# EasyEDA schematic SCH_Naked_ATMega_2560_2021-08-20.json
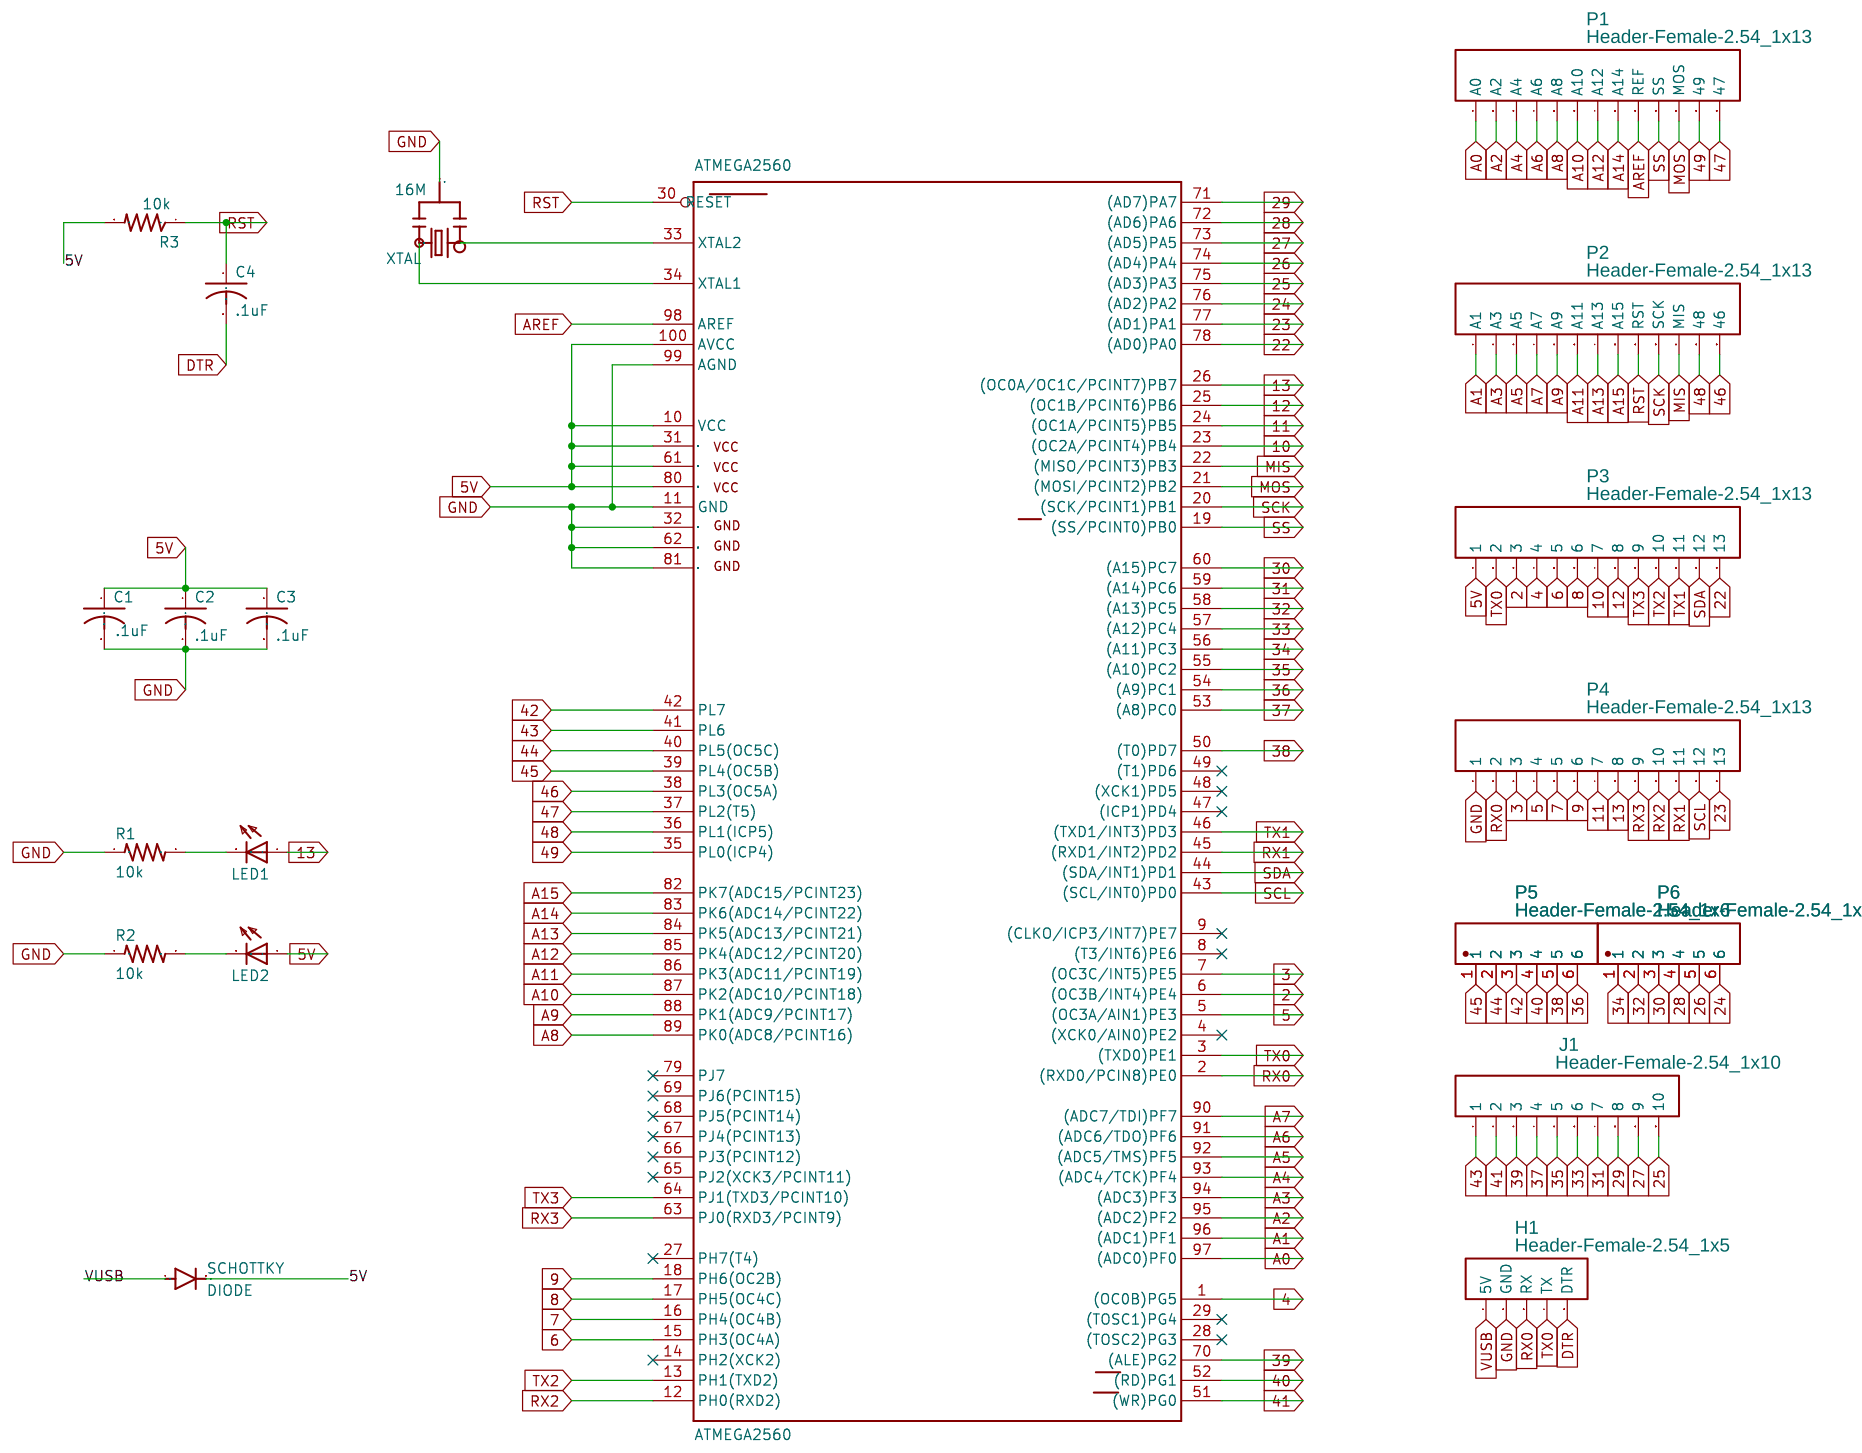
[diagram p0: schematic sheet]

## Parts
ATMEGA2560  ATMEGA2560  [TQFP100]
C1  CAPACITOR-SMD-0805  [SMD-0805]
C2  .1uF  [SMD-0805]
C3  .1uF  [SMD-0805]
C4  .1uF  [SMD-0805]
H1  Header-Female-2.54_1x5  [HDR-TH_5P-P2.54-V]
J1  Header-Female-2.54_1x10  [HDR-TH_10P-P2.54-V-F]
LED1  L  [SMD-0805-LED]
LED2  L  [SMD-0805-LED]
P1  Header-Female-2.54_1x13  [HDR-TH_13P-P2.54-V]
P2  Header-Female-2.54_1x13  [HDR-TH_13P-P2.54-V]
P3  Header-Female-2.54_1x13  [HDR-TH_13P-P2.54-V]
P4  Header-Female-2.54_1x13  [HDR-TH_13P-P2.54-V]
P5  Header-Female-2.54_1x6  [HDR-TH_6P-P2.54-V-F]
P6  Header-Female-2.54_1x6  [HDR-TH_6P-P2.54-V-F]
R1  10k  [SMD-0805]
R2  10k  [SMD-0805]
R3  10k  [SMD-0805]
SCHOTTKY  DIODE  [SOD-323F_L2.0-W1.6-LS2.5-RD]
XTAL  16M  [RESONATOR-WIDE-SMD]

## Library data of the parts
H1 = Header-Female-2.54_1x5: Supplier: LCSC; Manufacturer: BOOMELE; Manufacturer Part: 2.54mm 1*5p Female header; Supplier Part: C50950; JLCPCB Part Class: Extended Part
J1 = Header-Female-2.54_1x10: Supplier: LCSC; Manufacturer: BOOMELE; Manufacturer Part: 2.54mm 1*10P Straight Female header Gold-plated; Supplier Part: C35445; JLCPCB Part Class: Extended Part
P1-P4 = Header-Female-2.54_1x13: Supplier: LCSC; Manufacturer: BOOMELE; Manufacturer Part: Female header 2.54-1*13P; Supplier Part: C52709; JLCPCB Part Class: Extended Part
P5 P6 = Header-Female-2.54_1x6: Supplier: LCSC; Manufacturer: BOOMELE; Manufacturer Part: Female header 1*6p; Supplier Part: C40877; JLCPCB Part Class: Extended Part
XTAL = -: Package Display: No

## Nets
5V: ATMEGA2560.10(VCC) ATMEGA2560.31(VCC1) ATMEGA2560.61(VCC2) ATMEGA2560.80(VCC3) ATMEGA2560.100(AVCC) C1.1 C2.1 C3.1 LED2.1(A) P3.1 R3.2 SCHOTTKY.2(C)
GND: ATMEGA2560.11(GND) ATMEGA2560.32(GND1) ATMEGA2560.62(GND2) ATMEGA2560.81(GND3) ATMEGA2560.99(AGND) C1.2 C2.2 C3.2 H1.2(GND) P4.1 R1.1 R2.1 XTAL.2
2: ATMEGA2560.6((OC3B/INT4)PE4) P3.3
3: ATMEGA2560.7((OC3C/INT5)PE5) P4.3
4: ATMEGA2560.1((OC0B)PG5) P3.4
5: ATMEGA2560.5((OC3A/AIN1)PE3) P4.4
6: ATMEGA2560.15(PH3(OC4A)) P3.5
7: ATMEGA2560.16(PH4(OC4B)) P4.5
8: ATMEGA2560.17(PH5(OC4C)) P3.6
9: ATMEGA2560.18(PH6(OC2B)) P4.6
10: ATMEGA2560.23((OC2A/PCINT4)PB4) P3.7
11: ATMEGA2560.24((OC1A/PCINT5)PB5) P4.7
12: ATMEGA2560.25((OC1B/PCINT6)PB6) P3.8
13: ATMEGA2560.26((OC0A/OC1C/PCINT7)PB7) LED1.1(A) P4.8
22: ATMEGA2560.78((AD0)PA0) P3.13
23: ATMEGA2560.77((AD1)PA1) P4.13
24: ATMEGA2560.76((AD2)PA2) P6.6
25: ATMEGA2560.75((AD3)PA3) J1.10
26: ATMEGA2560.74((AD4)PA4) P6.5
27: ATMEGA2560.73((AD5)PA5) J1.9
28: ATMEGA2560.72((AD6)PA6) P6.4
29: ATMEGA2560.71((AD7)PA7) J1.8
30: ATMEGA2560.60((A15)PC7) P6.3
31: ATMEGA2560.59((A14)PC6) J1.7
32: ATMEGA2560.58((A13)PC5) P6.2
33: ATMEGA2560.57((A12)PC4) J1.6
34: ATMEGA2560.56((A11)PC3) P6.1
35: ATMEGA2560.55((A10)PC2) J1.5
36: ATMEGA2560.54((A9)PC1) P5.6
37: ATMEGA2560.53((A8)PC0) J1.4
38: ATMEGA2560.50((T0)PD7) P5.5
39: ATMEGA2560.70((ALE)PG2) J1.3
40: ATMEGA2560.52((RD)PG1) P5.4
41: ATMEGA2560.51((WR)PG0) J1.2
42: ATMEGA2560.42(PL7) P5.3
43: ATMEGA2560.41(PL6) J1.1
44: ATMEGA2560.40(PL5(OC5C)) P5.2
45: ATMEGA2560.39(PL4(OC5B)) P5.1
46: ATMEGA2560.38(PL3(OC5A)) P2.13(46)
47: ATMEGA2560.37(PL2(T5)) P1.13(47)
48: ATMEGA2560.36(PL1(ICP5)) P2.12(48)
49: ATMEGA2560.35(PL0(ICP4)) P1.12(49)
A0: ATMEGA2560.97((ADC0)PF0) P1.1(A0)
A1: ATMEGA2560.96((ADC1)PF1) P2.1(A1)
A2: ATMEGA2560.95((ADC2)PF2) P1.2(A2)
A3: ATMEGA2560.94((ADC3)PF3) P2.2(A3)
A4: ATMEGA2560.93((ADC4/TCK)PF4) P1.3(A4)
A5: ATMEGA2560.92((ADC5/TMS)PF5) P2.3(A5)
A6: ATMEGA2560.91((ADC6/TDO)PF6) P1.4(A6)
A7: ATMEGA2560.90((ADC7/TDI)PF7) P2.4(A7)
A8: ATMEGA2560.89(PK0(ADC8/PCINT16)) P1.5(A8)
A9: ATMEGA2560.88(PK1(ADC9/PCINT17)) P2.5(A9)
A10: ATMEGA2560.87(PK2(ADC10/PCINT18)) P1.6(A10)
A11: ATMEGA2560.86(PK3(ADC11/PCINT19)) P2.6(A11)
A12: ATMEGA2560.85(PK4(ADC12/PCINT20)) P1.7(A12)
A13: ATMEGA2560.84(PK5(ADC13/PCINT21)) P2.7(A13)
A14: ATMEGA2560.83(PK6(ADC14/PCINT22)) P1.8(A14)
A15: ATMEGA2560.82(PK7(ADC15/PCINT23)) P2.8(A15)
AREF: ATMEGA2560.98(AREF) P1.9(REF)
DTR: C4.2 H1.5(DTR)
MIS: ATMEGA2560.22((MISO/PCINT3)PB3) P2.11(MIS)
MOS: ATMEGA2560.21((MOSI/PCINT2)PB2) P1.11(MOS)
RST: ATMEGA2560.30(RESET) C4.1 P2.9(RST) R3.1
RX0: ATMEGA2560.2((RXD0/PCIN8)PE0) H1.3(RX) P4.2
RX1: ATMEGA2560.45((RXD1/INT2)PD2) P4.11
RX2: ATMEGA2560.12(PH0(RXD2)) P4.10
RX3: ATMEGA2560.63(PJ0(RXD3/PCINT9)) P4.9
SCK: ATMEGA2560.20((SCK/PCINT1)PB1) P2.10(SCK)
SCL: ATMEGA2560.43((SCL/INT0)PD0) P4.12
SDA: ATMEGA2560.44((SDA/INT1)PD1) P3.12
SS: ATMEGA2560.19((SS/PCINT0)PB0) P1.10(SS)
TX0: ATMEGA2560.3((TXD0)PE1) H1.4(TX) P3.2
TX1: ATMEGA2560.46((TXD1/INT3)PD3) P3.11
TX2: ATMEGA2560.13(PH1(TXD2)) P3.10
TX3: ATMEGA2560.64(PJ1(TXD3/PCINT10)) P3.9
VUSB: H1.1(5V) SCHOTTKY.1(A)
Net-(ATMEGA2560-33): ATMEGA2560.33(XTAL2) XTAL.1
Net-(ATMEGA2560-34): ATMEGA2560.34(XTAL1) XTAL.3
Net-(LED1-2): LED1.2(C) R1.2
Net-(LED2-2): LED2.2(C) R2.2

Not connected (* = marked no-connect by the designer): ATMEGA2560 4((XCK0/AIN0)PE2)* 8((T3/INT6)PE6)* 9((CLKO/ICP3/INT7)PE7)* 14(PH2(XCK2))* 27(PH7(T4))* 28((TOSC2)PG3)* 29((TOSC1)PG4)* 47((ICP1)PD4)* 48((XCK1)PD5)* 49((T1)PD6)* 65(PJ2(XCK3/PCINT11))* 66(PJ3(PCINT12))* 67(PJ4(PCINT13))* 68(PJ5(PCINT14))* 69(PJ6(PCINT15))* 79(PJ7)*

## Notes on the sheet
- .1uF
